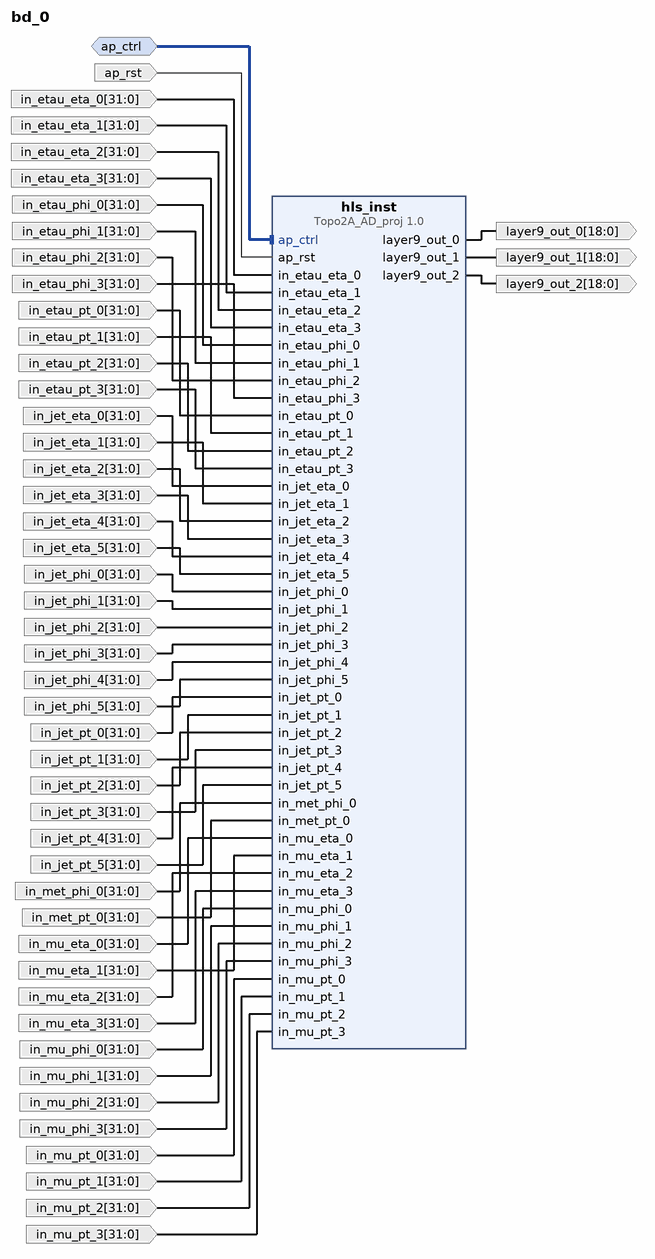
[diagram p0: block diagram of the top level]
# Vivado block design bd_0, xcvu9p-flga2104-2-e, Vivado 2024.1
create_bd_design bd_0

create_bd_intf_port -mode Slave -vlnv xilinx.com:interface:acc_handshake_rtl:1.0 ap_ctrl
create_bd_port -dir I -type rst ap_rst
set_property -dict {CONFIG.POLARITY ACTIVE_HIGH} [get_bd_ports ap_rst]
create_bd_port -dir I -from 31 -to 0 -type data in_etau_eta_0
create_bd_port -dir I -from 31 -to 0 -type data in_etau_eta_1
create_bd_port -dir I -from 31 -to 0 -type data in_etau_eta_2
create_bd_port -dir I -from 31 -to 0 -type data in_etau_eta_3
create_bd_port -dir I -from 31 -to 0 -type data in_etau_phi_0
create_bd_port -dir I -from 31 -to 0 -type data in_etau_phi_1
create_bd_port -dir I -from 31 -to 0 -type data in_etau_phi_2
create_bd_port -dir I -from 31 -to 0 -type data in_etau_phi_3
create_bd_port -dir I -from 31 -to 0 -type data in_etau_pt_0
create_bd_port -dir I -from 31 -to 0 -type data in_etau_pt_1
create_bd_port -dir I -from 31 -to 0 -type data in_etau_pt_2
create_bd_port -dir I -from 31 -to 0 -type data in_etau_pt_3
create_bd_port -dir I -from 31 -to 0 -type data in_jet_eta_0
create_bd_port -dir I -from 31 -to 0 -type data in_jet_eta_1
create_bd_port -dir I -from 31 -to 0 -type data in_jet_eta_2
create_bd_port -dir I -from 31 -to 0 -type data in_jet_eta_3
create_bd_port -dir I -from 31 -to 0 -type data in_jet_eta_4
create_bd_port -dir I -from 31 -to 0 -type data in_jet_eta_5
create_bd_port -dir I -from 31 -to 0 -type data in_jet_phi_0
create_bd_port -dir I -from 31 -to 0 -type data in_jet_phi_1
create_bd_port -dir I -from 31 -to 0 -type data in_jet_phi_2
create_bd_port -dir I -from 31 -to 0 -type data in_jet_phi_3
create_bd_port -dir I -from 31 -to 0 -type data in_jet_phi_4
create_bd_port -dir I -from 31 -to 0 -type data in_jet_phi_5
create_bd_port -dir I -from 31 -to 0 -type data in_jet_pt_0
create_bd_port -dir I -from 31 -to 0 -type data in_jet_pt_1
create_bd_port -dir I -from 31 -to 0 -type data in_jet_pt_2
create_bd_port -dir I -from 31 -to 0 -type data in_jet_pt_3
create_bd_port -dir I -from 31 -to 0 -type data in_jet_pt_4
create_bd_port -dir I -from 31 -to 0 -type data in_jet_pt_5
create_bd_port -dir I -from 31 -to 0 -type data in_met_phi_0
create_bd_port -dir I -from 31 -to 0 -type data in_met_pt_0
create_bd_port -dir I -from 31 -to 0 -type data in_mu_eta_0
create_bd_port -dir I -from 31 -to 0 -type data in_mu_eta_1
create_bd_port -dir I -from 31 -to 0 -type data in_mu_eta_2
create_bd_port -dir I -from 31 -to 0 -type data in_mu_eta_3
create_bd_port -dir I -from 31 -to 0 -type data in_mu_phi_0
create_bd_port -dir I -from 31 -to 0 -type data in_mu_phi_1
create_bd_port -dir I -from 31 -to 0 -type data in_mu_phi_2
create_bd_port -dir I -from 31 -to 0 -type data in_mu_phi_3
create_bd_port -dir I -from 31 -to 0 -type data in_mu_pt_0
create_bd_port -dir I -from 31 -to 0 -type data in_mu_pt_1
create_bd_port -dir I -from 31 -to 0 -type data in_mu_pt_2
create_bd_port -dir I -from 31 -to 0 -type data in_mu_pt_3
create_bd_port -dir O -from 18 -to 0 -type data layer9_out_0
create_bd_port -dir O -from 18 -to 0 -type data layer9_out_1
create_bd_port -dir O -from 18 -to 0 -type data layer9_out_2

create_bd_cell -type ip -vlnv xilinx.com:hls:Topo2A_AD_proj:1.0 hls_inst

# ---- connections ----

connect_bd_intf_net -intf_net ap_ctrl_0_1 [get_bd_intf_ports ap_ctrl] [get_bd_intf_pins hls_inst/ap_ctrl]
connect_bd_net -net ap_rst_0_1 [get_bd_ports ap_rst] [get_bd_pins hls_inst/ap_rst]
connect_bd_net [get_bd_pins hls_inst/layer9_out_0] [get_bd_ports layer9_out_0]
connect_bd_net [get_bd_pins hls_inst/layer9_out_1] [get_bd_ports layer9_out_1]
connect_bd_net [get_bd_pins hls_inst/layer9_out_2] [get_bd_ports layer9_out_2]
connect_bd_net -net in_etau_eta_0_0_1 [get_bd_ports in_etau_eta_0] [get_bd_pins hls_inst/in_etau_eta_0]
connect_bd_net -net in_etau_eta_1_0_1 [get_bd_ports in_etau_eta_1] [get_bd_pins hls_inst/in_etau_eta_1]
connect_bd_net -net in_etau_eta_2_0_1 [get_bd_ports in_etau_eta_2] [get_bd_pins hls_inst/in_etau_eta_2]
connect_bd_net -net in_etau_eta_3_0_1 [get_bd_ports in_etau_eta_3] [get_bd_pins hls_inst/in_etau_eta_3]
connect_bd_net -net in_etau_phi_0_0_1 [get_bd_ports in_etau_phi_0] [get_bd_pins hls_inst/in_etau_phi_0]
connect_bd_net -net in_etau_phi_1_0_1 [get_bd_ports in_etau_phi_1] [get_bd_pins hls_inst/in_etau_phi_1]
connect_bd_net -net in_etau_phi_2_0_1 [get_bd_ports in_etau_phi_2] [get_bd_pins hls_inst/in_etau_phi_2]
connect_bd_net -net in_etau_phi_3_0_1 [get_bd_ports in_etau_phi_3] [get_bd_pins hls_inst/in_etau_phi_3]
connect_bd_net -net in_etau_pt_0_0_1 [get_bd_ports in_etau_pt_0] [get_bd_pins hls_inst/in_etau_pt_0]
connect_bd_net -net in_etau_pt_1_0_1 [get_bd_ports in_etau_pt_1] [get_bd_pins hls_inst/in_etau_pt_1]
connect_bd_net -net in_etau_pt_2_0_1 [get_bd_ports in_etau_pt_2] [get_bd_pins hls_inst/in_etau_pt_2]
connect_bd_net -net in_etau_pt_3_0_1 [get_bd_ports in_etau_pt_3] [get_bd_pins hls_inst/in_etau_pt_3]
connect_bd_net -net in_jet_eta_0_0_1 [get_bd_ports in_jet_eta_0] [get_bd_pins hls_inst/in_jet_eta_0]
connect_bd_net -net in_jet_eta_1_0_1 [get_bd_ports in_jet_eta_1] [get_bd_pins hls_inst/in_jet_eta_1]
connect_bd_net -net in_jet_eta_2_0_1 [get_bd_ports in_jet_eta_2] [get_bd_pins hls_inst/in_jet_eta_2]
connect_bd_net -net in_jet_eta_3_0_1 [get_bd_ports in_jet_eta_3] [get_bd_pins hls_inst/in_jet_eta_3]
connect_bd_net -net in_jet_eta_4_0_1 [get_bd_ports in_jet_eta_4] [get_bd_pins hls_inst/in_jet_eta_4]
connect_bd_net -net in_jet_eta_5_0_1 [get_bd_ports in_jet_eta_5] [get_bd_pins hls_inst/in_jet_eta_5]
connect_bd_net -net in_jet_phi_0_0_1 [get_bd_ports in_jet_phi_0] [get_bd_pins hls_inst/in_jet_phi_0]
connect_bd_net -net in_jet_phi_1_0_1 [get_bd_ports in_jet_phi_1] [get_bd_pins hls_inst/in_jet_phi_1]
connect_bd_net -net in_jet_phi_2_0_1 [get_bd_ports in_jet_phi_2] [get_bd_pins hls_inst/in_jet_phi_2]
connect_bd_net -net in_jet_phi_3_0_1 [get_bd_ports in_jet_phi_3] [get_bd_pins hls_inst/in_jet_phi_3]
connect_bd_net -net in_jet_phi_4_0_1 [get_bd_ports in_jet_phi_4] [get_bd_pins hls_inst/in_jet_phi_4]
connect_bd_net -net in_jet_phi_5_0_1 [get_bd_ports in_jet_phi_5] [get_bd_pins hls_inst/in_jet_phi_5]
connect_bd_net -net in_jet_pt_0_0_1 [get_bd_ports in_jet_pt_0] [get_bd_pins hls_inst/in_jet_pt_0]
connect_bd_net -net in_jet_pt_1_0_1 [get_bd_ports in_jet_pt_1] [get_bd_pins hls_inst/in_jet_pt_1]
connect_bd_net -net in_jet_pt_2_0_1 [get_bd_ports in_jet_pt_2] [get_bd_pins hls_inst/in_jet_pt_2]
connect_bd_net -net in_jet_pt_3_0_1 [get_bd_ports in_jet_pt_3] [get_bd_pins hls_inst/in_jet_pt_3]
connect_bd_net -net in_jet_pt_4_0_1 [get_bd_ports in_jet_pt_4] [get_bd_pins hls_inst/in_jet_pt_4]
connect_bd_net -net in_jet_pt_5_0_1 [get_bd_ports in_jet_pt_5] [get_bd_pins hls_inst/in_jet_pt_5]
connect_bd_net -net in_met_phi_0_0_1 [get_bd_ports in_met_phi_0] [get_bd_pins hls_inst/in_met_phi_0]
connect_bd_net -net in_met_pt_0_0_1 [get_bd_ports in_met_pt_0] [get_bd_pins hls_inst/in_met_pt_0]
connect_bd_net -net in_mu_eta_0_0_1 [get_bd_ports in_mu_eta_0] [get_bd_pins hls_inst/in_mu_eta_0]
connect_bd_net -net in_mu_eta_1_0_1 [get_bd_ports in_mu_eta_1] [get_bd_pins hls_inst/in_mu_eta_1]
connect_bd_net -net in_mu_eta_2_0_1 [get_bd_ports in_mu_eta_2] [get_bd_pins hls_inst/in_mu_eta_2]
connect_bd_net -net in_mu_eta_3_0_1 [get_bd_ports in_mu_eta_3] [get_bd_pins hls_inst/in_mu_eta_3]
connect_bd_net -net in_mu_phi_0_0_1 [get_bd_ports in_mu_phi_0] [get_bd_pins hls_inst/in_mu_phi_0]
connect_bd_net -net in_mu_phi_1_0_1 [get_bd_ports in_mu_phi_1] [get_bd_pins hls_inst/in_mu_phi_1]
connect_bd_net -net in_mu_phi_2_0_1 [get_bd_ports in_mu_phi_2] [get_bd_pins hls_inst/in_mu_phi_2]
connect_bd_net -net in_mu_phi_3_0_1 [get_bd_ports in_mu_phi_3] [get_bd_pins hls_inst/in_mu_phi_3]
connect_bd_net -net in_mu_pt_0_0_1 [get_bd_ports in_mu_pt_0] [get_bd_pins hls_inst/in_mu_pt_0]
connect_bd_net -net in_mu_pt_1_0_1 [get_bd_ports in_mu_pt_1] [get_bd_pins hls_inst/in_mu_pt_1]
connect_bd_net -net in_mu_pt_2_0_1 [get_bd_ports in_mu_pt_2] [get_bd_pins hls_inst/in_mu_pt_2]
connect_bd_net -net in_mu_pt_3_0_1 [get_bd_ports in_mu_pt_3] [get_bd_pins hls_inst/in_mu_pt_3]

validate_bd_design
save_bd_design
